# Altium schematic sheet Current_Sensing_Model.SchDoc
size A4
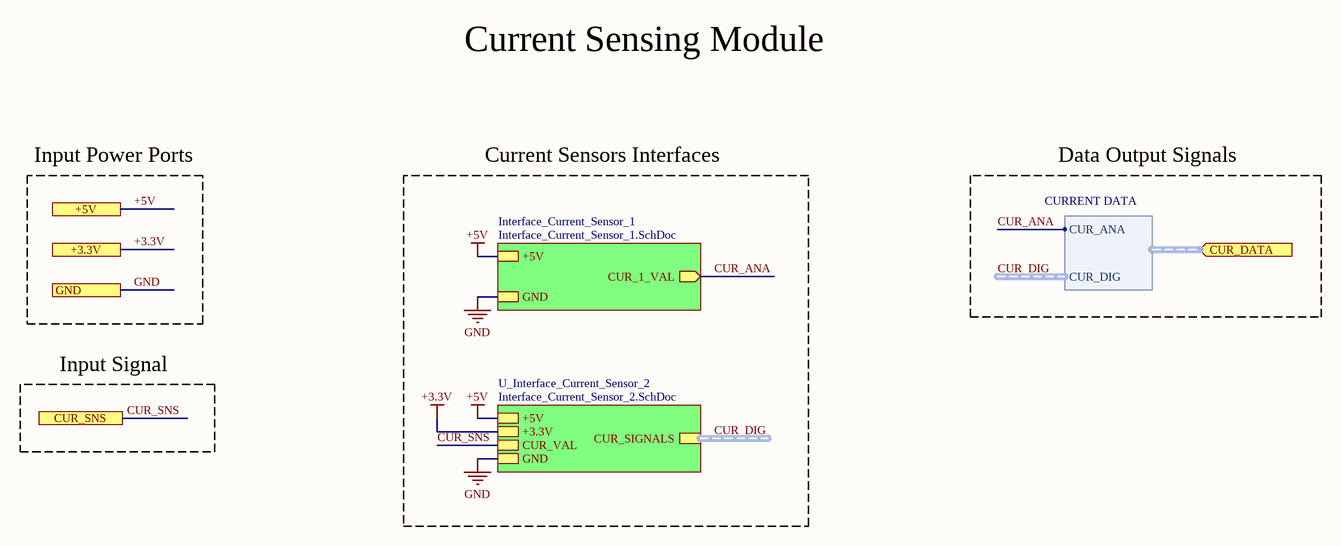
[diagram p0: Current_Sensing_Model.SchDoc]

## Sub-sheets
Interface_Current_Sensor_1 = Interface_Current_Sensor_1.SchDoc: GND, +5V, CUR_1_VAL (out)
U_Interface_Current_Sensor_2 = Interface_Current_Sensor_2.SchDoc: GND, +5V, +3.3V, CUR_SIGNALS (harness CURRENT SIGNALS), CUR_VAL

## Ports
+3.3V, +5V, CUR_DATA (in, harness CURRENT DATA), CUR_SNS, GND

## Harnesses
CURRENT DATA: CUR_ANA, CUR_DIG

## Nets
+3.3V: port +3.3V, sheet U_Interface_Current_Sensor_2/+3.3V
+5V: port +5V, sheet Interface_Current_Sensor_1/+5V, sheet U_Interface_Current_Sensor_2/+5V
GND: port GND, sheet Interface_Current_Sensor_1/GND, sheet U_Interface_Current_Sensor_2/GND
CUR_ANA: sheet Interface_Current_Sensor_1/CUR_1_VAL, port CUR_DATA.CUR_ANA
CUR_SNS: port CUR_SNS, sheet U_Interface_Current_Sensor_2/CUR_VAL

## Buses and harness runs
harness CUR_DIG = sheet U_Interface_Current_Sensor_2/CUR_SIGNALS

## Notes on the sheet
- Current Sensing Module
- Input Power Ports
- Current Sensors Interfaces
- Data Output Signals
- Input Signal